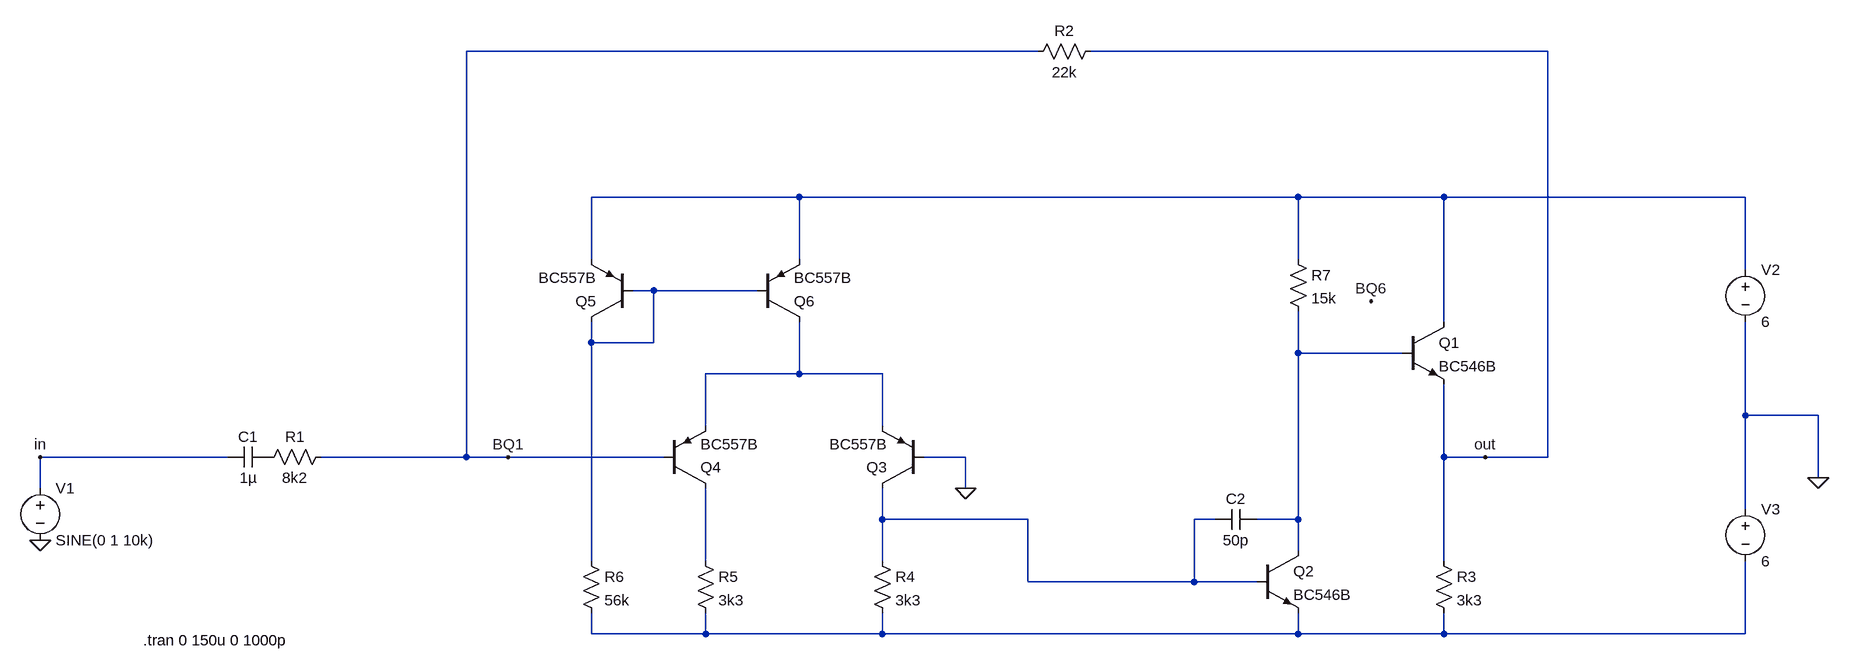
[diagram p0: schematic Draft2.asc]
Draft2.asc, the LTspice schematic file:
Version 4
SHEET 1 2580 680
WIRE 1360 -544 480 -544
WIRE 2144 -544 1440 -544
WIRE 992 -320 672 -320
WIRE 1760 -320 992 -320
WIRE 1984 -320 1760 -320
WIRE 2448 -320 1984 -320
WIRE 672 -224 672 -320
WIRE 992 -224 992 -320
WIRE 1760 -224 1760 -320
WIRE 2448 -208 2448 -320
WIRE 768 -176 736 -176
WIRE 928 -176 768 -176
WIRE 1984 -128 1984 -320
WIRE 672 -96 672 -128
WIRE 768 -96 768 -176
WIRE 768 -96 672 -96
WIRE 1760 -80 1760 -144
WIRE 1920 -80 1760 -80
WIRE 992 -48 992 -128
WIRE 992 -48 848 -48
WIRE 1120 -48 992 -48
WIRE 2448 16 2448 -128
WIRE 2560 16 2448 16
WIRE 848 32 848 -48
WIRE 1120 32 1120 -48
WIRE 112 80 -176 80
WIRE 480 80 480 -544
WIRE 480 80 256 80
WIRE 544 80 480 80
WIRE 784 80 544 80
WIRE 1248 80 1184 80
WIRE 1760 176 1760 -80
WIRE 1984 80 1984 -32
WIRE 2048 80 1984 80
WIRE 2144 80 2144 -544
WIRE 2144 80 2048 80
WIRE 2560 112 2560 16
WIRE -176 128 -176 80
WIRE 1248 128 1248 80
WIRE 2448 160 2448 16
WIRE 1120 176 1120 128
WIRE 1344 176 1120 176
WIRE 1632 176 1600 176
WIRE 1760 176 1696 176
WIRE 1760 224 1760 176
WIRE 672 240 672 -96
WIRE 848 240 848 128
WIRE 1120 240 1120 176
WIRE 1984 240 1984 80
WIRE 1344 272 1344 176
WIRE 1600 272 1600 176
WIRE 1600 272 1344 272
WIRE 1696 272 1600 272
WIRE 672 352 672 320
WIRE 848 352 848 320
WIRE 848 352 672 352
WIRE 1120 352 1120 320
WIRE 1120 352 848 352
WIRE 1760 352 1760 320
WIRE 1760 352 1120 352
WIRE 1984 352 1984 320
WIRE 1984 352 1760 352
WIRE 2448 352 2448 240
WIRE 2448 352 1984 352
FLAG 2560 112 0
FLAG 1248 128 0
FLAG 2048 80 out
FLAG -176 208 0
FLAG -176 80 in
FLAG 1872 -160 BQ6
FLAG 544 80 BQ1
SYMBOL voltage -176 112 R0
WINDOW 123 0 0 Left 0
WINDOW 39 0 0 Left 0
SYMATTR InstName V1
SYMATTR Value SINE(0 1 10k)
SYMBOL cap 176 64 R90
WINDOW 0 0 32 VBottom 2
WINDOW 3 32 32 VTop 2
SYMATTR InstName C1
SYMATTR Value 1µ
SYMBOL res 272 64 R90
WINDOW 0 0 56 VBottom 2
WINDOW 3 32 56 VTop 2
SYMATTR InstName R1
SYMATTR Value 8k2
SYMBOL res 1456 -560 R90
WINDOW 0 0 56 VBottom 2
WINDOW 3 32 56 VTop 2
SYMATTR InstName R2
SYMATTR Value 22k
SYMBOL voltage 2448 -224 R0
WINDOW 123 0 0 Left 0
WINDOW 39 0 0 Left 0
SYMATTR InstName V2
SYMATTR Value 6
SYMBOL voltage 2448 144 R0
WINDOW 123 0 0 Left 0
WINDOW 39 0 0 Left 0
SYMATTR InstName V3
SYMATTR Value 6
SYMBOL npn 1920 -128 R0
SYMATTR InstName Q1
SYMATTR Value BC546B
SYMBOL npn 1696 224 R0
SYMATTR InstName Q2
SYMATTR Value BC546B
SYMBOL pnp 736 -128 R180
SYMATTR InstName Q5
SYMATTR Value BC557B
SYMBOL pnp 928 -128 M180
SYMATTR InstName Q6
SYMATTR Value BC557B
SYMBOL res 1968 224 R0
SYMATTR InstName R3
SYMATTR Value 3k3
SYMBOL res 1104 224 R0
SYMATTR InstName R4
SYMATTR Value 3k3
SYMBOL res 832 224 R0
SYMATTR InstName R5
SYMATTR Value 3k3
SYMBOL res 656 224 R0
SYMATTR InstName R6
SYMATTR Value 56k
SYMBOL res 1744 -240 R0
SYMATTR InstName R7
SYMATTR Value 15k
SYMBOL cap 1696 160 R90
WINDOW 0 0 32 VBottom 2
WINDOW 3 32 32 VTop 2
SYMATTR InstName C2
SYMATTR Value 50p
SYMBOL pnp 1184 128 R180
SYMATTR InstName Q3
SYMATTR Value BC557B
SYMBOL pnp 784 128 M180
SYMATTR InstName Q4
SYMATTR Value BC557B
TEXT -18 362 Left 2 !.tran 0 150u 0 1000p

The netlist it stands for:
* Draft2.asc
V1 in 0 SINE(0 1 10k)
C1 P001 in 1µ
R1 BQ1 P001 8k2
R2 out BQ1 22k
V2 N001 0 6
V3 0 N007 6
Q1 N001 N003 out 0 BC546B
Q2 N003 N005 N007 0 BC546B
Q5 N002 N002 N001 0 BC557B
Q6 N004 N002 N001 0 BC557B
R3 out N007 3k3
R4 N005 N007 3k3
R5 N006 N007 3k3
R6 N002 N007 56k
R7 N001 N003 15k
C2 N003 N005 50p
Q3 N005 0 N004 0 BC557B
Q4 N006 BQ1 N004 0 BC557B
.model NPN NPN
.model PNP PNP
.lib standard.bjt
.tran 0 150u 0 1000p
.backanno
.end